# Altium schematic sheet 001-0002_beaglebone_cape_board.SchDoc: Beaglebone Cape Board
size A3; Author: HILT; SheetNumber: 1; SheetTotal: 1; ProjectTitle: 001-0002
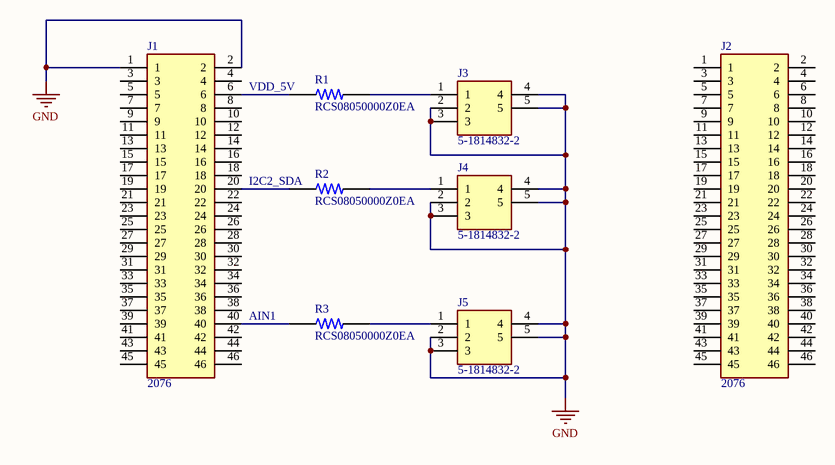
[diagram p0: 001-0002_beaglebone_cape_board.SchDoc]

## Parts
J1  2076  [HDRV46W64P254_2X23_5842X500X874P]
J2  2076  [HDRV46W64P254_2X23_5842X500X874P]
J3  5-1814832-2  [5-1814832-2]
J4  5-1814832-2  [5-1814832-2]
J5  5-1814832-2  [5-1814832-2]
R1  RCS08050000Z0EA  [RESC2012X50N]
R2  RCS08050000Z0EA  [RESC2012X50N]
R3  RCS08050000Z0EA  [RESC2012X50N]

## Nets
GND: J1.1 J1.2 J3.2 J3.3 J3.4 J3.5 J4.2 J4.3 J4.4 J4.5 J5.2 J5.3 J5.4 J5.5
NetJ1_6: J1.6 R1.1
NetJ1_20: J1.20 R2.1
NetJ1_40: J1.40 R3.1
NetJ3_1: J3.1 R1.2
NetJ4_1: J4.1 R2.2
NetJ5_1: J5.1 R3.2

Not connected (* = marked no-connect by the designer): J1 3 4 5 7 8 9 10 11 12 13 14 15 16 17 18 19 21 22 23 24 25 26 27 28 29 30 31 32 33 34 35 36 37 38 39 41 42 43 44 45 46; J2 1 2 3 4 5 6 7 8 9 10 11 12 13 14 15 16 17 18 19 20 21 22 23 24 25 26 27 28 29 30 31 32 33 34 35 36 37 38 39 40 41 42 43 44 45 46

## Notes on the sheet
- VDD_5V
- (near R2) I2C2_SDA
- AIN1
- Title:
- Author:
- Approved:
- Size:
- Date:
- Git Hash:
- A3
- Prj:
- SW Version:
- Variant:
- Edited:
- File:

## Library data of the parts
J1 J2 = 2076: Adafruit Accessories 2x23 Male Headers for BeagleBone Black - Two Pack; Geometry.Height: 8.74mm; Mouser Part Number: 485-2076; Mouser Price/Stock: https://www.mouser.co.uk/ProductDetail/Adafruit/2076?qs=GURawfaeGuBAvD7rncVFUg%3D%3D; Manufacturer_Name: Adafruit; Manufacturer_Part_Number: 2076; Datasheet Link: https://cdn-shop.adafruit.com/datasheets/16188.pdf
J3-J5 = 5-1814832-2: SMA Connector Jack, Female Socket 50 Ohms Through Hole Solder; Manufacturer_Name: TE Connectivity; Geometry.Height: 9.5mm; Mouser Part Number: 571-5-1814832-2; Mouser Price/Stock: https://www.mouser.co.uk/ProductDetail/TE-Connectivity/5-1814832-2?qs=Cb2nCFKsA8rPOrkEMAAQ4A%3D%3D; Manufacturer_Part_Number: 5-1814832-2; Datasheet Link: https://www.te.com/commerce/DocumentDelivery/DDEController?Action=srchrtrv&DocNm=1-1773725-8_RF_COAX_QRG&DocType=Data%20Sheet&DocLang=English&PartCntxt=5-1814832-2&DocFormat=pdf
R1-R3 = RCS08050000Z0EA: RES SMD 0 OHM JUMPER 1/2W 0805; MF: Vishay Dale; Package: 2012 Vishay; Check_prices: https://www.snapeda.com/parts/RCS08050000Z0EA/Vishay%20Dale/view-part/922781/?ref=eda; Digi-Key_Part_Number: 541-2827-1-ND; Value: *; MP: RCS08050000Z0EA; Purchase-URL: https://pricing.snapeda.com/search/part/RCS08050000Z0EA/?ref=eda; SnapEDA_Link: https://www.snapeda.com/parts/RCS08050000Z0EA/Vishay%20Dale/view-part/922781/?ref=snap